# Altium schematic sheet PCB_Project_11 Э3 (Питание).SchDoc
size 420 x 297 mm; SheetNumber: 1; SheetTotal: 1
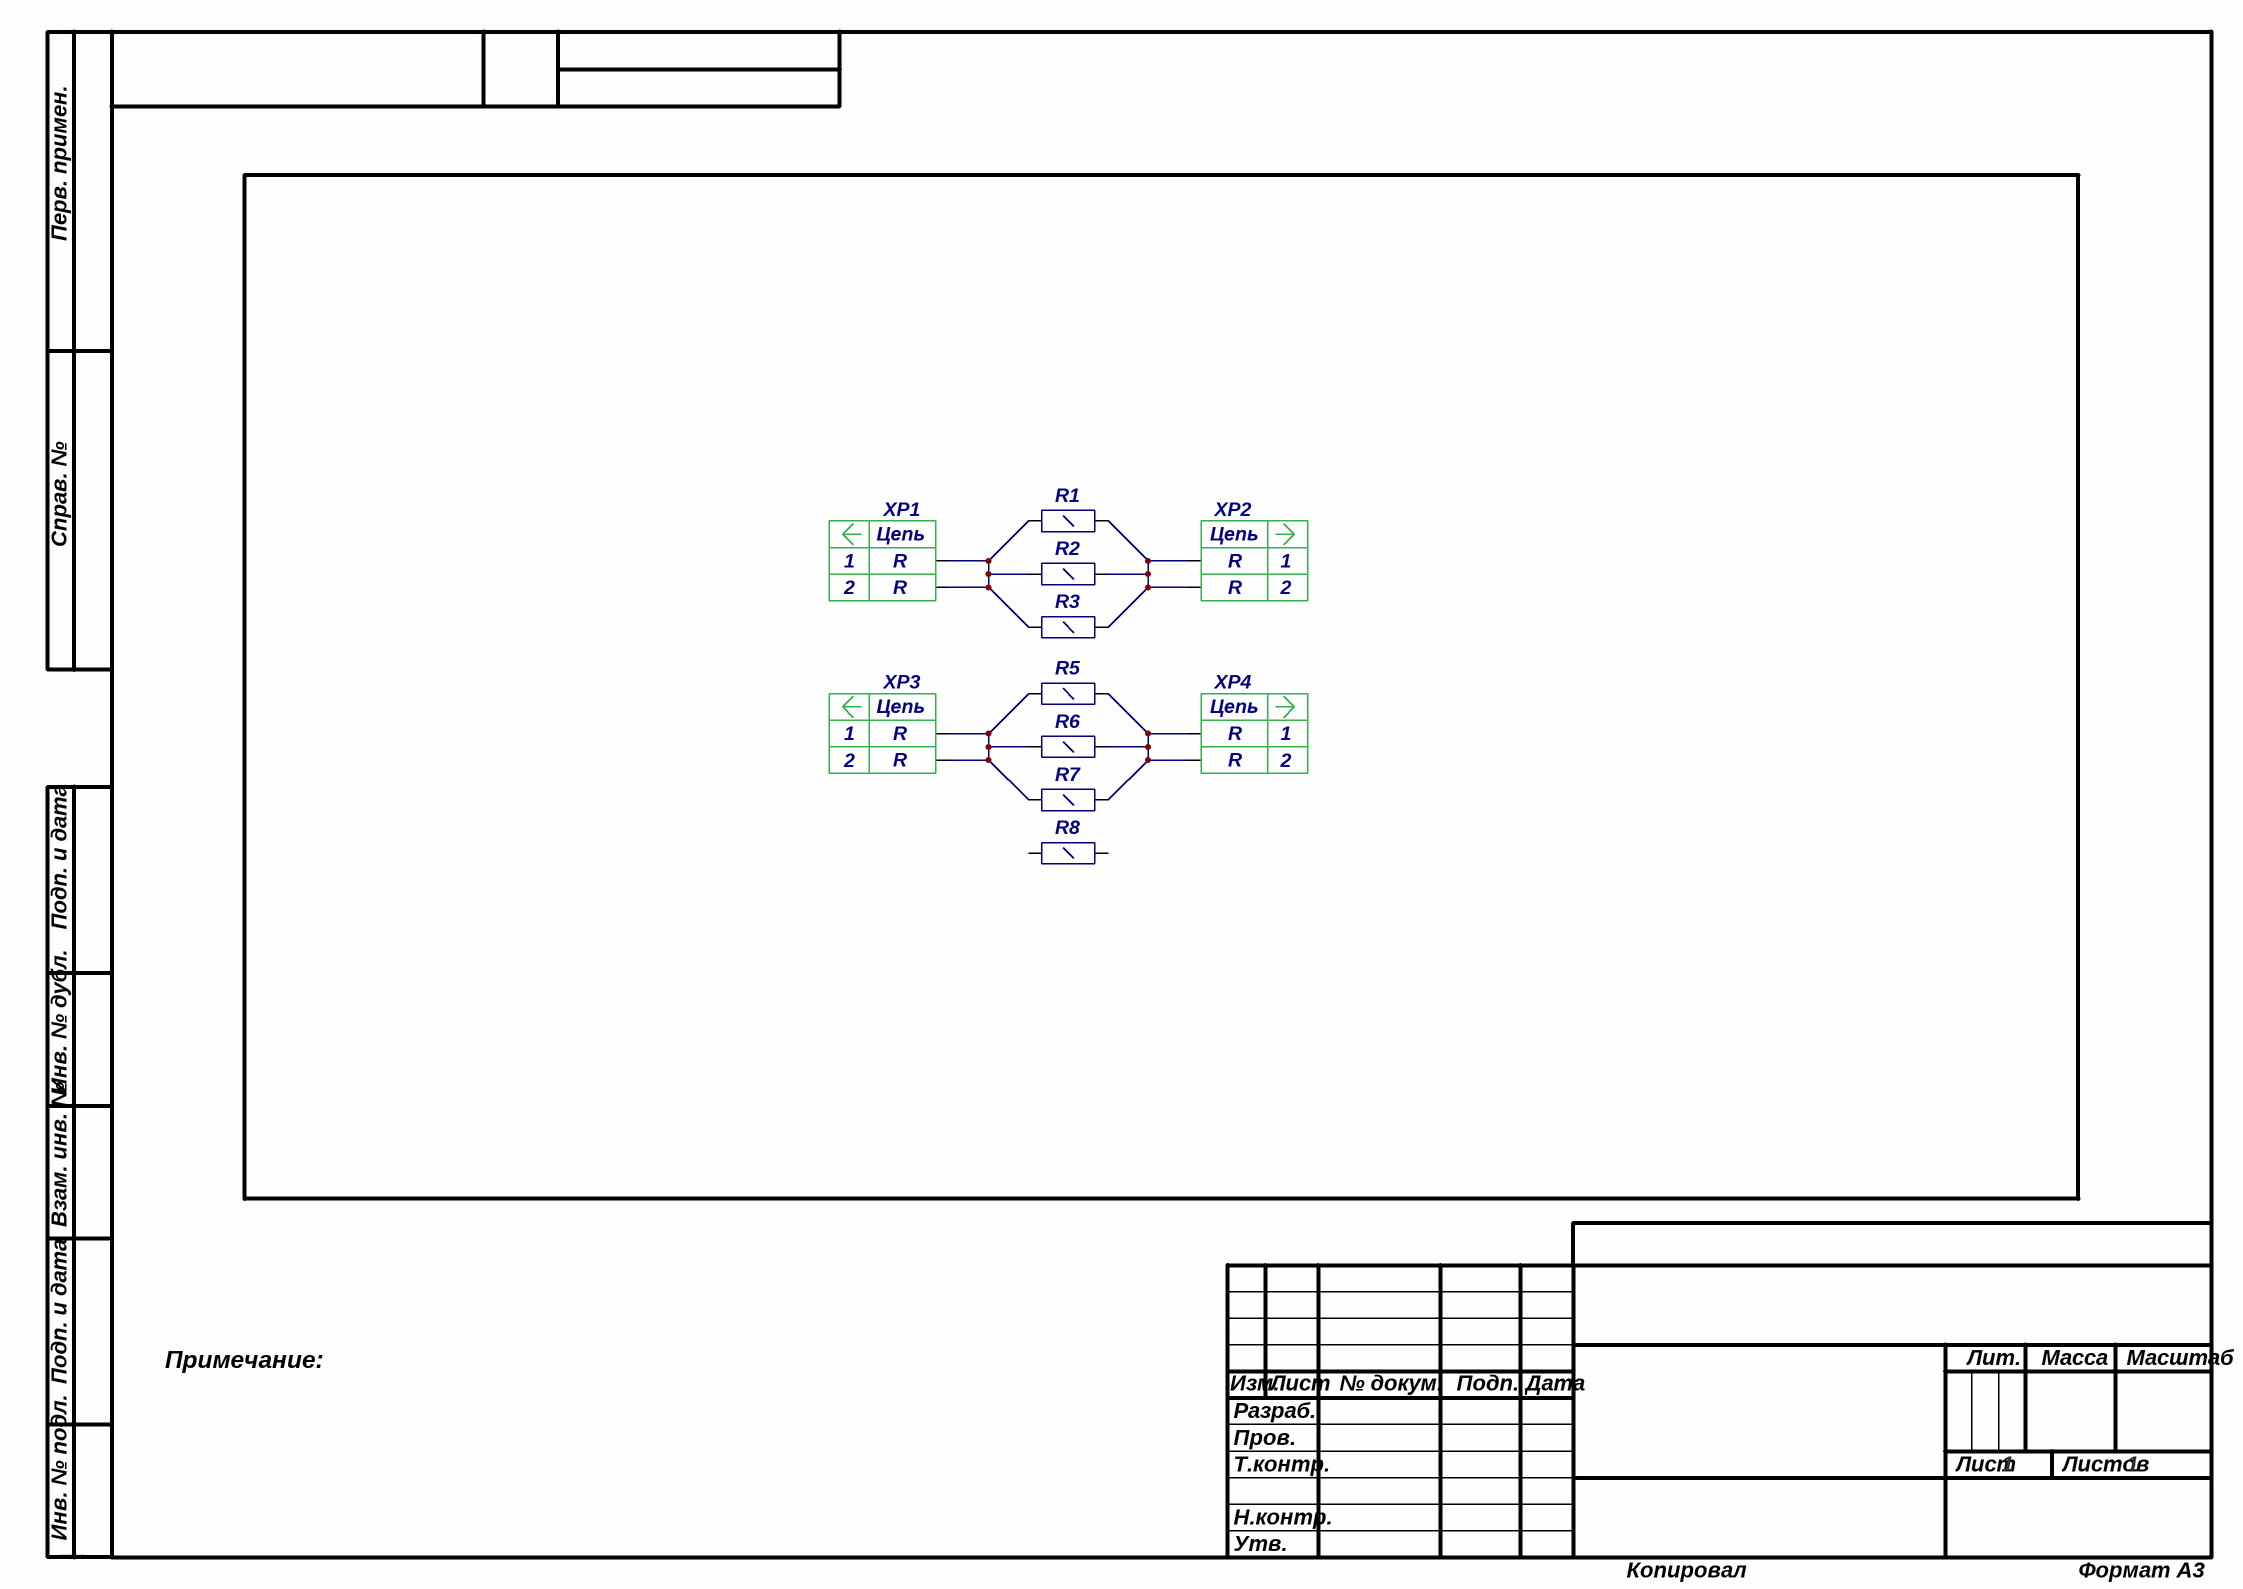
[diagram p0: PCB_Project_11 Э3 (Питание).SchDoc]

## Parts
R1  RC1206FR-072RL  [1206_(RES)]  (value not drawn)
R2  RC1206FR-072RL  [1206_(RES)]  (value not drawn)
R3  RC1206FR-072RL  [1206_(RES)]  (value not drawn)
R5  RC1206FR-072RL  [1206_(RES)]  (value not drawn)
R6  RC1206FR-072RL  [1206_(RES)]  (value not drawn)
R7  RC1206FR-072RL  [1206_(RES)]  (value not drawn)
R8  RC1206FR-072RL  [1206_(RES)]  (value not drawn)
XP1  2: R  [15EDGVM-3.5-02P-14-00A(H)]  (hidden comment: 15EDGVM-3.5-02P)
XP2  2: R  [15EDGVM-3.5-02P-14-00A(H)]  (hidden comment: 15EDGVM-3.5-02P)
XP3  2: R  [15EDGVM-3.5-02P-14-00A(H)]  (hidden comment: 15EDGVM-3.5-02P)
XP4  2: R  [15EDGVM-3.5-02P-14-00A(H)]  (hidden comment: 15EDGVM-3.5-02P)

## Nets
NetR1_1: R1.1 R2.1 R3.1 XP1.1 XP1.2
NetR1_2: R1.2 R2.2 R3.2 XP2.1 XP2.2
NetR5_1: R5.1 R6.1 R7.1 XP3.1 XP3.2
NetR5_2: R5.2 R6.2 R7.2 XP4.1 XP4.2

Not connected (* = marked no-connect by the designer): R8 1 2

## Notes on the sheet
- Примечание:
- Перв. примен.
- Справ. №
- Подп. и дата
- Инв. № дубл.
- Взам. инв. №
- Изм.
- Разраб.
- Лист
- № докум.
- Подп.
- Дата
- Лит.
- Масса
- Масштаб
- Пров.
- Т.контр.
- Листов
- Инв. № подл.
- Н.контр.
- Утв.
- ALTIUM GOSTBOM2.0 KEV
- Копировал
- Формат А3
- (in symbol 15EDGVM-3.5-02P) Цепь

## Library data of the parts
R1 = RC1206FR-072RL: RES SMD 2 OHM 1% 1/4W 1206; Manufacturer: Yageo; ManufacturerPartNumber: ПППРР; Value: 2 Ом; Наименование: ПППРР 2 Ом 1% 1206 Yageo; Category: Резистор; ComponentLink1URL: http://www.yageo.com/documents/recent/PYu-RC_Group_51_RoHS_L_04.pdf; CasePackage: 1206; ComponentLink1Description: Datasheet; Tolerance: 1%
R2 R3 R5-R8 = RC1206FR-072RL: RES SMD 2 OHM 1% 1/4W 1206; Manufacturer: Yageo; Value: 2 Ом; Наименование: RC1206FR-072RL 2 Ом 1% 1206 Yageo; Category: Резистор; ComponentLink1URL: http://www.yageo.com/documents/recent/PYu-RC_Group_51_RoHS_L_04.pdf; CasePackage: 1206; ComponentLink1Description: Datasheet; Tolerance: 1%; ManufacturerPartNumber: RC1206FR-072RL
XP1-XP4 = 15EDGVM-3.5-02P: vertical, screw, 7A, 250V, 3.5mm; Manufacturer: DEGSON; Наименование: 15EDGVM-3.5-02P DEGSON; developer: Коннов; Category: Вилка; ManufacturerPartNumber: 15EDGVM-3.5-02P; ComponentLink1Description: degson_details; ComponentLink1URL: https://www.degson.com/content/details_552_4151594.html?lang=en; development_date: 12.12.2023; 1: R